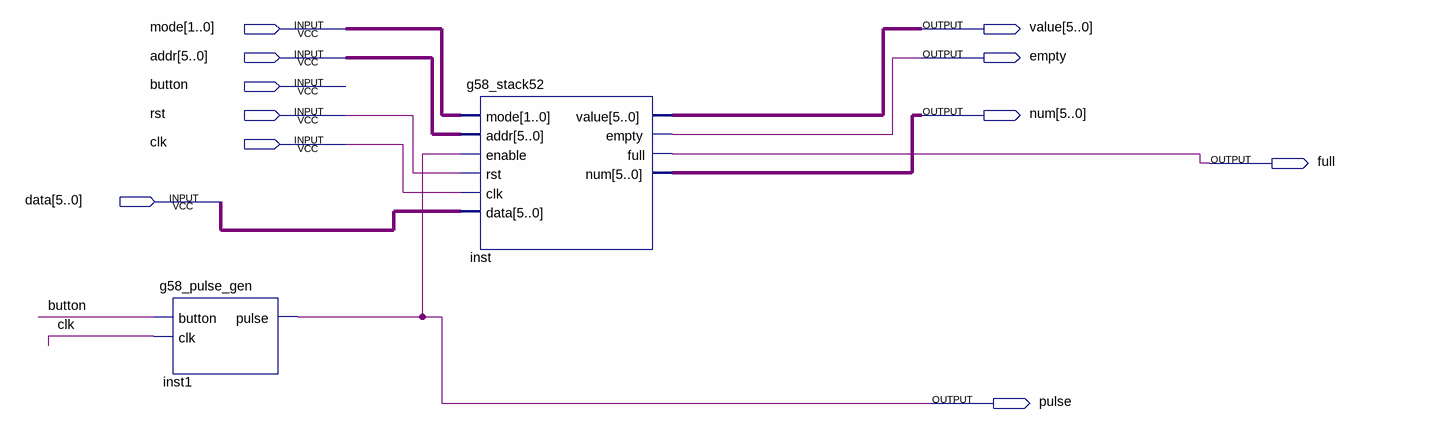
[diagram p0: schematic sheet]
// Quartus schematic g58_lab3.bdf as structural Verilog: 2 symbols, 11 pins
module g58_lab3 (
  input  [1:0] mode,
  input  [5:0] addr,
  input  button,
  input  rst,
  input  clk,
  input  [5:0] data,
  output [5:0] value,
  output empty,
  output [5:0] num,
  output full,
  output pulse
);

  g58_pulse_gen inst1 (.button(button), .clk(clk), .pulse(pulse));
  g58_stack52 inst (
    .mode(mode), .addr(addr), .enable(pulse), .rst(rst), .clk(clk), .data(data), .value(value),
    .empty(empty), .full(full), .num(num));
endmodule
